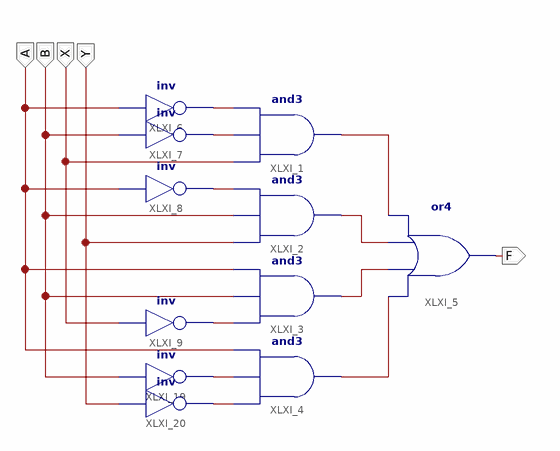
[diagram p0: schematic sheet 1]
// Xilinx ISE schematic Exp3Schematic.sch (spartan3e) as structural Verilog: 11 symbols, 5 ports
module Exp3Schematic (
  input  Y,
  input  X,
  input  B,
  input  A,
  output F
);

  wire XLXN_1, XLXN_2, XLXN_4, XLXN_7, XLXN_8, XLXN_9, XLXN_10, XLXN_11, XLXN_12, XLXN_13;

  and XLXI_1 (XLXN_7, X, XLXN_12, XLXN_13);
  and XLXI_2 (XLXN_1, Y, B, XLXN_11);
  and XLXI_3 (XLXN_2, XLXN_10, B, A);
  and XLXI_4 (XLXN_4, XLXN_8, XLXN_9, A);
  or XLXI_5 (F, XLXN_4, XLXN_2, XLXN_1, XLXN_7);
  not XLXI_6 (XLXN_13, A);
  not XLXI_7 (XLXN_12, B);
  not XLXI_8 (XLXN_11, A);
  not XLXI_9 (XLXN_10, X);
  not XLXI_19 (XLXN_9, B);
  not XLXI_20 (XLXN_8, Y);
endmodule
